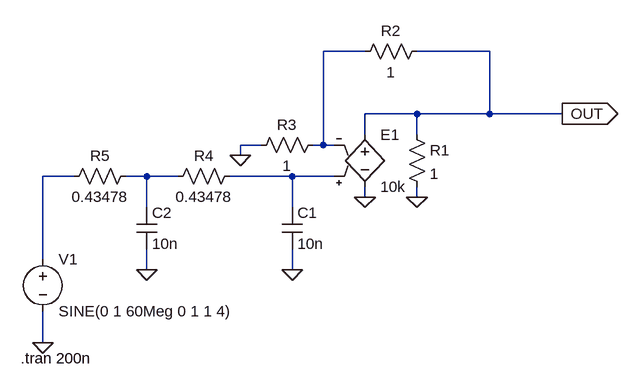
[diagram p0: schematic 2nd order butterworth low pass filter.asc]
2nd order butterworth low pass filter.asc, the LTspice schematic file:
Version 4
SHEET 1 880 680
WIRE 96 -16 32 -16
WIRE 288 -16 176 -16
WIRE 176 80 96 80
WIRE 288 80 288 -16
WIRE 288 80 176 80
WIRE 400 80 288 80
WIRE 96 112 96 80
WIRE 176 112 176 80
WIRE -64 128 -96 128
WIRE 32 128 32 -16
WIRE 32 128 16 128
WIRE 48 128 32 128
WIRE -96 144 -96 128
WIRE -352 176 -400 176
WIRE -240 176 -272 176
WIRE -192 176 -240 176
WIRE -16 176 -112 176
WIRE 48 176 -16 176
WIRE 96 208 96 192
WIRE 176 208 176 192
WIRE -240 224 -240 176
WIRE -16 224 -16 176
WIRE -400 304 -400 176
WIRE -240 320 -240 288
WIRE -16 320 -16 288
WIRE -400 432 -400 384
FLAG 96 208 0
FLAG 176 208 0
FLAG 400 80 OUT
IOPIN 400 80 Out
FLAG -96 144 0
FLAG -16 320 0
FLAG -240 320 0
FLAG -400 432 0
SYMBOL res 160 96 R0
SYMATTR InstName R1
SYMATTR Value 1
SYMBOL e2 96 96 R0
SYMATTR InstName E1
SYMATTR Value 10k
SYMBOL res 192 -32 R90
WINDOW 0 0 56 VBottom 2
WINDOW 3 32 56 VTop 2
SYMATTR InstName R2
SYMATTR Value 1
SYMBOL res 32 112 R90
WINDOW 0 0 56 VBottom 2
WINDOW 3 32 56 VTop 2
SYMATTR InstName R3
SYMATTR Value 1
SYMBOL res -96 160 R90
WINDOW 0 0 56 VBottom 2
WINDOW 3 32 56 VTop 2
SYMATTR InstName R4
SYMATTR Value 0.43478
SYMBOL cap -32 224 R0
SYMATTR InstName C1
SYMATTR Value 10n
SYMBOL cap -256 224 R0
SYMATTR InstName C2
SYMATTR Value 10n
SYMBOL res -256 160 R90
WINDOW 0 0 56 VBottom 2
WINDOW 3 32 56 VTop 2
SYMATTR InstName R5
SYMATTR Value 0.43478
SYMBOL voltage -400 288 R0
WINDOW 123 0 0 Left 0
WINDOW 39 0 0 Left 0
SYMATTR InstName V1
SYMATTR Value SINE(0 1 60Meg 0 1 1 4)
TEXT -434 456 Left 2 !.tran 200n

The netlist it stands for:
* 2nd order butterworth low pass filter.asc
R1 OUT 0 1
E1 OUT 0 N004 N001 10k
R2 OUT N001 1
R3 N001 0 1
R4 N004 N003 0.43478
C1 N004 0 10n
C2 N003 0 10n
R5 N003 N002 0.43478
V1 N002 0 SINE(0 1 60Meg 0 1 1 4)
.tran 200n
.backanno
.end